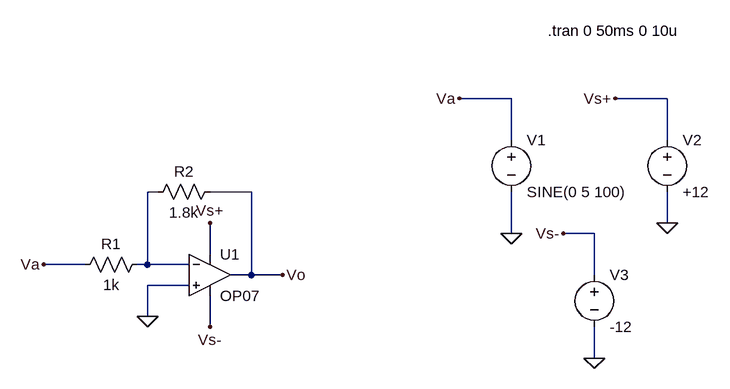
[diagram p0: schematic Draft3.asc]
Draft3.asc, the LTspice schematic file:
Version 4
SHEET 1 1004 680
WIRE 688 -112 608 -112
WIRE 928 -112 848 -112
WIRE 688 -48 688 -112
WIRE 928 -48 928 -112
WIRE 144 32 128 32
WIRE 288 32 224 32
WIRE 928 80 928 32
WIRE 688 96 688 32
WIRE 816 96 768 96
WIRE 224 128 224 80
WIRE 32 144 -32 144
WIRE 128 144 128 32
WIRE 128 144 112 144
WIRE 192 144 128 144
WIRE 288 160 288 32
WIRE 288 160 256 160
WIRE 336 160 288 160
WIRE 816 160 816 96
WIRE 192 176 128 176
WIRE 128 224 128 176
WIRE 224 240 224 192
WIRE 816 288 816 240
FLAG 128 224 0
FLAG 688 96 0
FLAG 816 288 0
FLAG 928 80 0
FLAG 608 -112 Va
FLAG 848 -112 Vs+
FLAG 768 96 Vs-
FLAG 224 80 Vs+
FLAG 224 240 Vs-
FLAG -32 144 Va
FLAG 336 160 Vo
SYMBOL OpAmps\\OP07 224 96 R0
SYMATTR InstName U1
SYMBOL res 128 128 R90
WINDOW 0 0 56 VBottom 2
WINDOW 3 32 56 VTop 2
SYMATTR InstName R1
SYMATTR Value 1k
SYMBOL res 240 16 R90
WINDOW 0 0 56 VBottom 2
WINDOW 3 32 56 VTop 2
SYMATTR InstName R2
SYMATTR Value 1.8k
SYMBOL voltage 688 -64 R0
WINDOW 123 0 0 Left 0
WINDOW 39 0 0 Left 0
SYMATTR InstName V1
SYMATTR Value SINE(0 5 100)
SYMBOL voltage 928 -64 R0
WINDOW 123 0 0 Left 0
WINDOW 39 0 0 Left 0
SYMATTR InstName V2
SYMATTR Value +12
SYMBOL voltage 816 144 R0
WINDOW 123 0 0 Left 0
WINDOW 39 0 0 Left 0
SYMATTR InstName V3
SYMATTR Value -12
TEXT 744 -216 Left 2 !.tran 0 50ms 0 10u

The netlist it stands for:
* Draft3.asc
XU1 0 N001 Vs+ Vs- Vo LT1001  ; OP07, pins In+ In- V+ V- OUT
R1 N001 Va 1k
R2 Vo N001 1.8k
V1 Va 0 SINE(0 5 100)
V2 Vs+ 0 +12
V3 Vs- 0 -12
.tran 0 50ms 0 10u
.lib LTC.lib
.backanno
.end

* Results of the author's LTspice run, read from the files saved beside the schematic
* Operating Point, zero values left out:
*   V(vs+) = 12 V
*   V(vs-) = -12 V
*   I(V3) = 2.25 mA
*   I(V2) = -2.25 mA
*   Ix(u1:3) = 2.25 mA
*   Ix(u1:4) = -2.25 mA
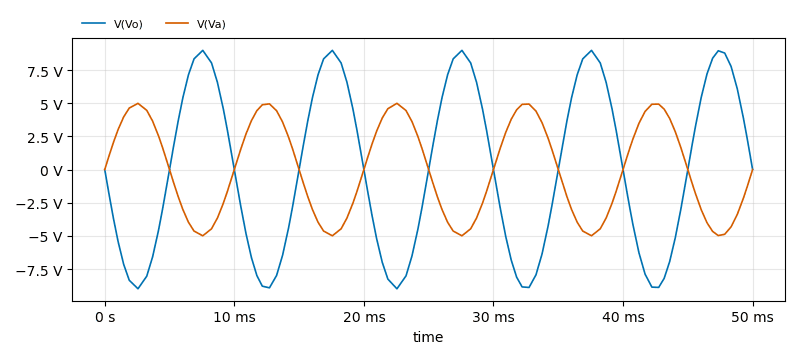
[diagram p1: Transient Analysis of Draft3.asc, plotted from the saved traces]
* Transient Analysis, 1 run:
*   V(Vo): min -8.993 V, max 8.99 V, average -2.31 mV, rms 6.331 V, last 3.011 mV
*   V(Va): min -4.995 V, max 4.996 V, average 1.283 mV, rms 3.517 V, last 0 V